# EAGLE design hv_relay_array (EAGLE 9.3.0)
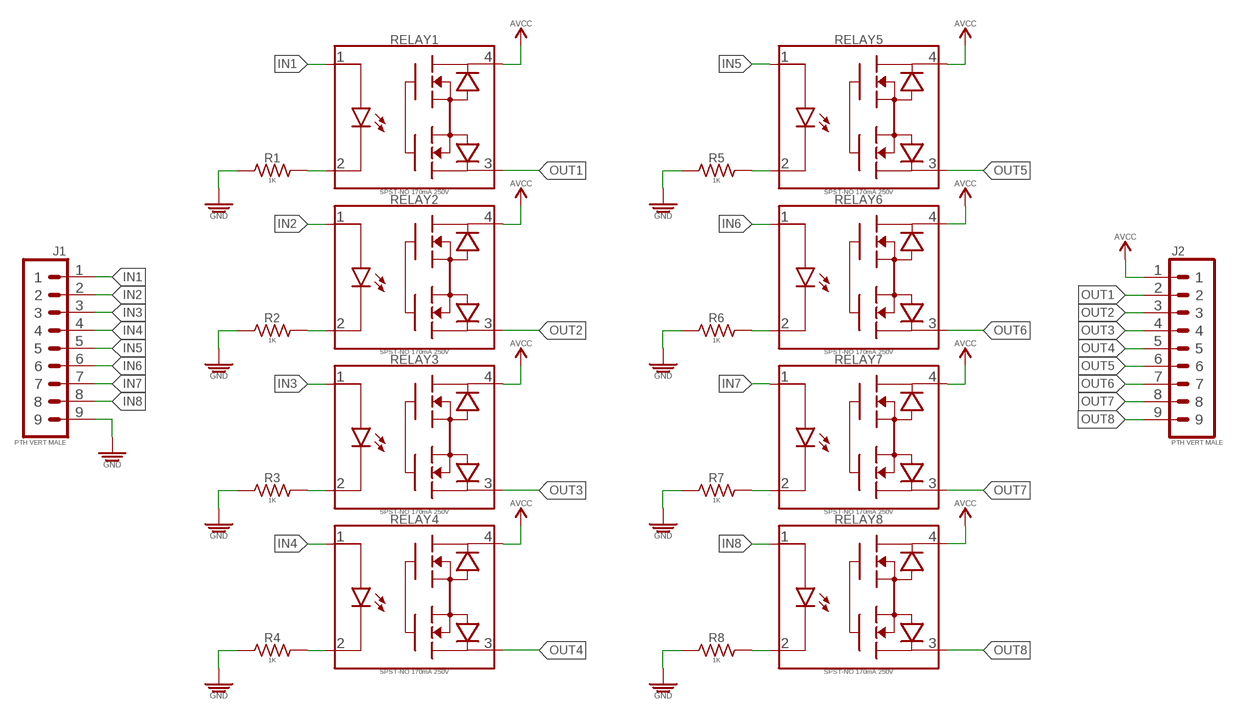
[diagram p0: schematic, sheet 1]

## Parts
J1  PTH VERT MALE  1X09_PTH_VERT_MALE_2.54MM  [HDRV9W64P254_1X9_2286X254X838B]
J2  PTH VERT MALE  1X09_PTH_VERT_MALE_2.54MM  [HDRV9W64P254_1X9_2286X254X838B]
R1  1K  1KΩ_SMD-0402_1/16W-5%  [RESC1005X35_SMD-0402]
R2  1K  1KΩ_SMD-0402_1/16W-5%  [RESC1005X35_SMD-0402]
R3  1K  1KΩ_SMD-0402_1/16W-5%  [RESC1005X35_SMD-0402]
R4  1K  1KΩ_SMD-0402_1/16W-5%  [RESC1005X35_SMD-0402]
R5  1K  1KΩ_SMD-0402_1/16W-5%  [RESC1005X35_SMD-0402]
R6  1K  1KΩ_SMD-0402_1/16W-5%  [RESC1005X35_SMD-0402]
R7  1K  1KΩ_SMD-0402_1/16W-5%  [RESC1005X35_SMD-0402]
R8  1K  1KΩ_SMD-0402_1/16W-5%  [RESC1005X35_SMD-0402]
RELAY1  SPST-NO 170mA 250V  RELAY_SOLID-STATE_SSR_170MA_250V_SPST-NO  [SOP254P609X203-4]
RELAY2  SPST-NO 170mA 250V  RELAY_SOLID-STATE_SSR_170MA_250V_SPST-NO  [SOP254P609X203-4]
RELAY3  SPST-NO 170mA 250V  RELAY_SOLID-STATE_SSR_170MA_250V_SPST-NO  [SOP254P609X203-4]
RELAY4  SPST-NO 170mA 250V  RELAY_SOLID-STATE_SSR_170MA_250V_SPST-NO  [SOP254P609X203-4]
RELAY5  SPST-NO 170mA 250V  RELAY_SOLID-STATE_SSR_170MA_250V_SPST-NO  [SOP254P609X203-4]
RELAY6  SPST-NO 170mA 250V  RELAY_SOLID-STATE_SSR_170MA_250V_SPST-NO  [SOP254P609X203-4]
RELAY7  SPST-NO 170mA 250V  RELAY_SOLID-STATE_SSR_170MA_250V_SPST-NO  [SOP254P609X203-4]
RELAY8  SPST-NO 170mA 250V  RELAY_SOLID-STATE_SSR_170MA_250V_SPST-NO  [SOP254P609X203-4]

## Nets
AVCC: J2.1 RELAY1.4 RELAY2.4 RELAY3.4 RELAY4.4 RELAY5.4 RELAY6.4 RELAY7.4 RELAY8.4
GND: J1.9 R1.1 R2.1 R3.1 R4.1 R5.1 R6.1 R7.1 R8.1
IN1: J1.1 RELAY1.1
IN2: J1.2 RELAY2.1
IN3: J1.3 RELAY3.1
IN4: J1.4 RELAY4.1
IN5: J1.5 RELAY5.1
IN6: J1.6 RELAY6.1
IN7: J1.7 RELAY7.1
IN8: J1.8 RELAY8.1
N$1: R1.2 RELAY1.2
N$2: R2.2 RELAY2.2
N$3: R3.2 RELAY3.2
N$4: R4.2 RELAY4.2
N$5: R5.2 RELAY5.2
N$18: R6.2 RELAY6.2
N$19: R7.2 RELAY7.2
N$20: R8.2 RELAY8.2
OUT1: J2.2 RELAY1.3
OUT2: J2.3 RELAY2.3
OUT3: J2.4 RELAY3.3
OUT4: J2.5 RELAY4.3
OUT5: J2.6 RELAY5.3
OUT6: J2.7 RELAY6.3
OUT7: J2.8 RELAY7.3
OUT8: J2.9 RELAY8.3

## Library data of the parts
J1 J2 = _connectors:1X09; DATASHEET: https://drawings-pdf.s3.amazonaws.com/C10436.pdf; DIST: Digikey; DISTLINK: https://www.digikey.com/products/en?keywords=S1012E-09-ND; DISTPN: S1012E-09-ND; MFR: Sullins Connector Solutions; MPN: PEC09SAAN
R1-R8 = _resistors:1KΩ; DATASHEET: http://www.yageo.com/documents/recent/PYu-RC_Group_51_RoHS_L_9.pdf; DIST: Digikey; DISTLINK: https://www.digikey.com/products/en?keywords=311-1.0KJRCT-ND; DISTPN: 311-1.0KJRCT-ND; MFR: Yageo; MPN: RC0402JR-071KL
RELAY1-RELAY8 = _relay:RELAY_SOLID-STATE; DATASHEET: http://www.ixysic.com/home/pdfs.nsf/www/CPC1010N.pdf/$file/CPC1010N.pdf; DIST: Digikey; DISTLINK: https://www.digikey.com/products/en?keywords=CPC1010N-ND; DISTPN: CPC1010N-ND; MFR: IXYS Integrated Circuits Division; MPN: CPC1010N

## Board
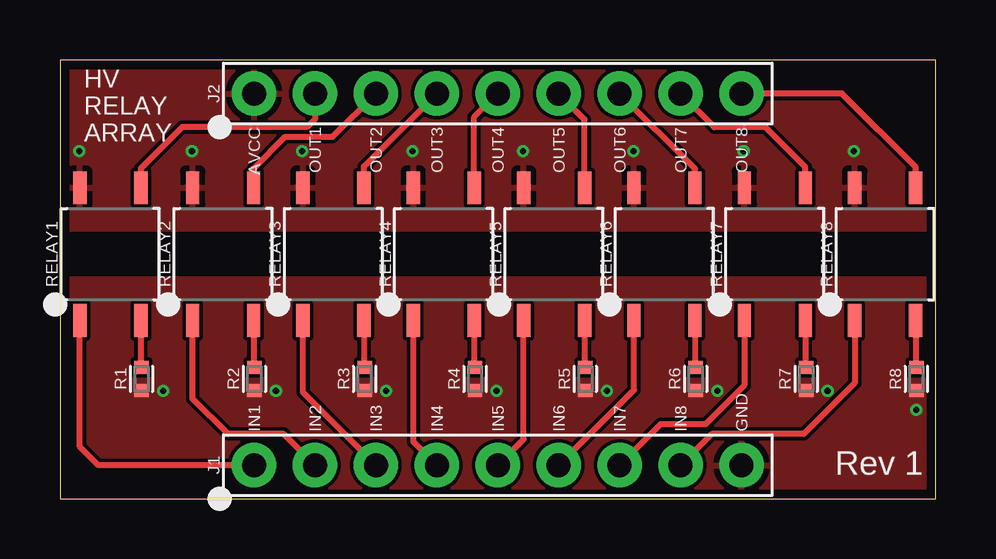
[diagram p1: board, top side]
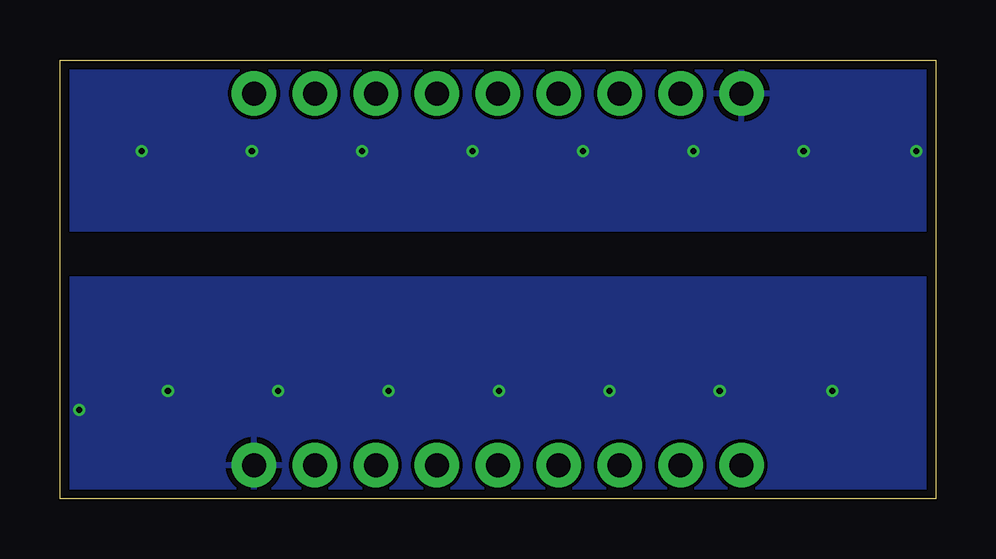
[diagram p2: board, bottom side, seen from below]

Size 36.5 x 18.3 mm. Coordinates in mm from the lower left corner, seen from the top.
Outline: 0,0 36.5,0 36.5,18.3 0,18.3 0,0
Copper layers (1*16): Top 0.035559375mm / dielectric 1.6mm / Bottom 0.035559375mm
Design rules "oshpark-2layer": minimum track width 6mil, minimum drill 10mil, track to track 6mil, track to pad 6mil, pad to pad 6mil, via to via 6mil, smd to smd 6mil, copper to edge 15mil, drill to drill 6mil, minimum pad ring 5mil, minimum via ring 5mil, stop-mask expansion 2.5mil, vias tented up to drill 0mil, thermal gap 10mil

### Footprints (pad centres in the part's own frame; a part is rotated, then mirrored left to right if it is on the bottom)
HDRV9W64P254_1X9_2286X254X838B = drill 1 pad 1.85: 1 -10.16,0; 2 -7.62,0; 3 -5.08,0; 4 -2.54,0; 5 0,0; 6 2.54,0; 7 5.08,0; 8 7.62,0; 9 10.16,0
RESC1005X35_SMD-0402 = smd 0.535 x 0.6: 1 -0.482,0; 2 0.482,0
SOP254P609X203-4 = smd 1.371 x 0.553: 1 -2.768,1.27; 2 -2.768,-1.27; 3 2.768,-1.27; 4 2.768,1.27

### Placement (x,y rotation side)
J1  18.25,1.4 0 top
J2  18.25,16.9 0 top
R1  3.4,5 90 top
R2  8.1,5 90 top
R3  12.7,5 90 top
R4  17.3,5 90 top
R5  21.9,5 90 top
R6  26.5,5 90 top
R7  31.1,5 90 top
R8  35.7,5 90 top
RELAY1  2.1,10.2 90 top
RELAY2  6.8,10.2 90 top
RELAY3  11.4,10.2 90 top
RELAY4  16,10.2 90 top
RELAY5  20.6,10.2 90 top
RELAY6  25.2,10.2 90 top
RELAY7  29.8,10.2 90 top
RELAY8  34.4,10.2 90 top

### Tracks (layer width: path | path; a pad name or v marks a point on that pad's centre or on a via)
AVCC  (via drill 0.25)
  other vias: 0.8,14.5 5.5,14.5 10.1,14.5 14.7,14.5 19.3,14.5 23.9,14.5 28.5,14.5 33.1,14.5
  pour Bottom: 0,18.3 0,11.2 36.5,11.2 36.5,18.3
  pour Top: 0,18.3 0,11.2 36.5,11.2 36.5,18.3
GND  (via drill 0.25)
  other vias: 4.3,4.5 9,4.5 13.6,4.5 18.2,4.5 22.8,4.5 27.4,4.5 32,4.5 35.7,3.7
  pour Bottom: 0,9.2 0,0 36.5,0 36.5,9.2
  pour Top: 0,9.2 0,0 36.5,0 36.5,9.2
IN1
  Top 0.254: J1.1 1.6,1.4 0.83,2.17 RELAY1.1
IN2
  Top 0.254: J1.2 9.33,2.7 7,2.7 5.53,4.17 RELAY2.1
IN3
  Top 0.254: J1.3 10.13,4.44 RELAY3.1
IN4
  Top 0.254: J1.4 14.73,2.38 RELAY4.1
IN5
  Top 0.254: J1.5 19.33,2.48 RELAY5.1
IN6
  Top 0.254: J1.6 23.93,4.54 RELAY6.1
IN7
  Top 0.254: RELAY7.1 28.53,4.73 26.91,3.11 25.04,3.11 J1.7
IN8
  Top 0.254: J1.8 27.17,2.7 31,2.7 33.13,4.83 RELAY8.1
N$1
  Top 0.254: RELAY1.2 3.37,5.51 R1.2
N$2
  Top 0.254: RELAY2.2 8.07,5.51 R2.2
N$3
  Top 0.254: RELAY3.2 12.67,5.51 R3.2
N$4
  Top 0.254: RELAY4.2 17.27,5.51 R4.2
N$5
  Top 0.254: RELAY5.2 21.87,5.51 R5.2
N$18
  Top 0.254: RELAY6.2 26.47,5.51 R6.2
N$19
  Top 0.254: RELAY7.2 31.07,5.51 R7.2
N$20
  Top 0.254: RELAY8.2 35.67,5.51 R8.2
OUT1
  Top 0.254: J2.2 10.63,15.83 10.3,15.5 5.1,15.5 3.37,13.77 RELAY1.3
OUT2
  Top 0.254: RELAY2.3 8.07,13.77 9.39,15.09 11.36,15.09 J2.3
OUT3
  Top 0.254: RELAY3.3 12.67,13.86 J2.4
OUT4
  Top 0.254: RELAY4.3 17.27,15.92 J2.5
OUT5
  Top 0.254: RELAY5.3 21.87,15.82 J2.6
OUT6
  Top 0.254: RELAY6.3 26.47,13.76 J2.7
OUT7
  Top 0.254: RELAY7.3 31.07,13.83 29.41,15.49 27.28,15.49 J2.8
OUT8
  Top 0.254: RELAY8.3 35.67,13.83 32.6,16.9 J2.9

### Text on the board
tPlace: HV / RELAY / ARRAY | AVCC | OUT1 | OUT2 | OUT3 | OUT4 | OUT5 | OUT6 | OUT7 | OUT8 | IN1 | IN2 | IN3 | IN4 | IN5 | IN6 | IN7 | IN8 | GND | Rev 1